# EAGLE schematic PM_proto_1 (EAGLE 8.7.0)
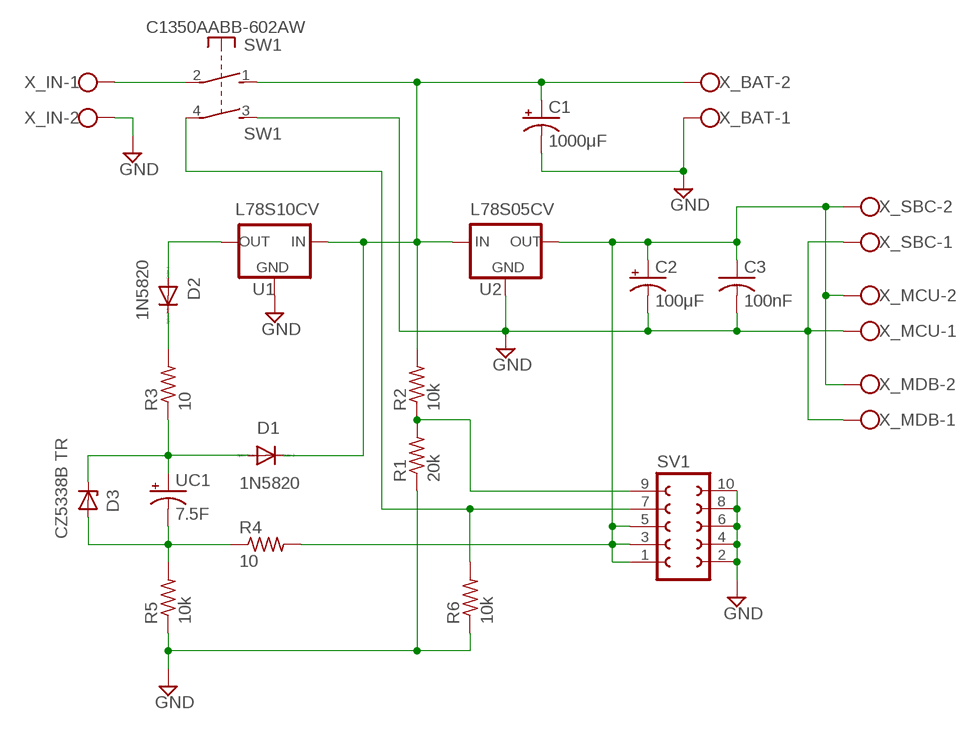
[diagram p0: schematic, sheet 1]

## Parts
C1  1000μF  CPOL-USE2,5-6E  [E2,5-6E]
C2  100μF  CPOL-USE2,5-6E  [E2,5-6E]
C3  100nF  C-US025-024X044  [C025-024X044]
D1  1N5820  1N4004  [DO41-10]
D2  1N5820  1N4004  [DO41-10]
D3  CZ5338B TR  1N4728  [DO41Z10]
R1  20k  R-US_0204/7  [0204/7]
R2  10k  R-US_0204/7  [0204/7]
R3  10  R-US_0204/7  [0204/7]
R4  10  R-US_0204/7  [0204/7]
R5  10k  R-US_0204/7  [0204/7]
R6  10k  R-US_0204/7  [0204/7]
SV1  FE05-2  [FE05-2]
SW1  C1350AABB-602AW  PVA1  [PVA1F]
U1  L78S10CV  78XXS  [78XXS]
U2  L78S05CV  78XXS  [78XXS]
UC1  7.5F  CPOL-USETR4  [ETR4]
X_BAT  W237-102  [W237-102]
X_IN  W237-102  [W237-102]
X_MCU  W237-102  [W237-102]
X_MDB  W237-102  [W237-102]
X_SBC  W237-102  [W237-102]

## Nets
GND: C1.- C2.- C3.2 R1.1 R5.1 R6.1 SV1.2 SV1.4 SV1.6 SV1.8 SV1.10 SW1.3(2:S) U1.GND U2.GND X_BAT.1 X_IN.2 X_MCU.1 X_MDB.1 X_SBC.1
N$1: R1.2 R2.1 SV1.9
N$2: D2.A U1.OUT
N$3: D2.C R3.2
N$4: D1.A D3.C R3.1 UC1.+
N$5: D3.A R4.1 R5.2 UC1.-
N$6: C1.+ D1.C R2.2 SW1.1(1:S) U1.IN U2.IN X_BAT.2
N$7: SW1.2(1:P) X_IN.1
N$8: C2.+ C3.1 R4.2 SV1.1 SV1.3 SV1.5 U2.OUT X_MCU.2 X_MDB.2 X_SBC.2
N$9: R6.2 SV1.7 SW1.4(2:P)

## Library data of the parts
C1 C2 UC1 = rcl:CPOL-US: POLARIZED CAPACITOR, American symbol; SPICEPREFIX: C
C3 = rcl:C-US: CAPACITOR, American symbol; SPICEPREFIX: C
D1 D2 = diode:1N4004: DIODE general purpose rectifier, 1 A
D3 = diode:1N4728: Z DIODE 3.3 V, 1W, 5 percent
R1-R6 = rcl:R-US_: RESISTOR, American symbol; SPICEPREFIX: R
SV1 = con-lsta:FE05-2: FEMALE HEADER; OC_FARNELL: unknown; OC_NEWARK: unknown
SW1 = switch-misc:PVA1: ITT SWITCH
U1 = v-reg:78XXS: VOLTAGE REGULATOR
U2 = v-reg:78XXS: VOLTAGE REGULATOR; SPICEPREFIX: J
X_BAT X_IN X_MCU X_MDB X_SBC = con-wago-500:W237-102: WAGO SCREW CLAMP; MPN: 237-102; OC_FARNELL: unknown; OC_NEWARK: 70K9898